# EAGLE design tritag (EAGLE 6.5.0)
AUTHOR: Brad Campbell; REV: A; TITLE: TriTag

## Sheet 1 of 2
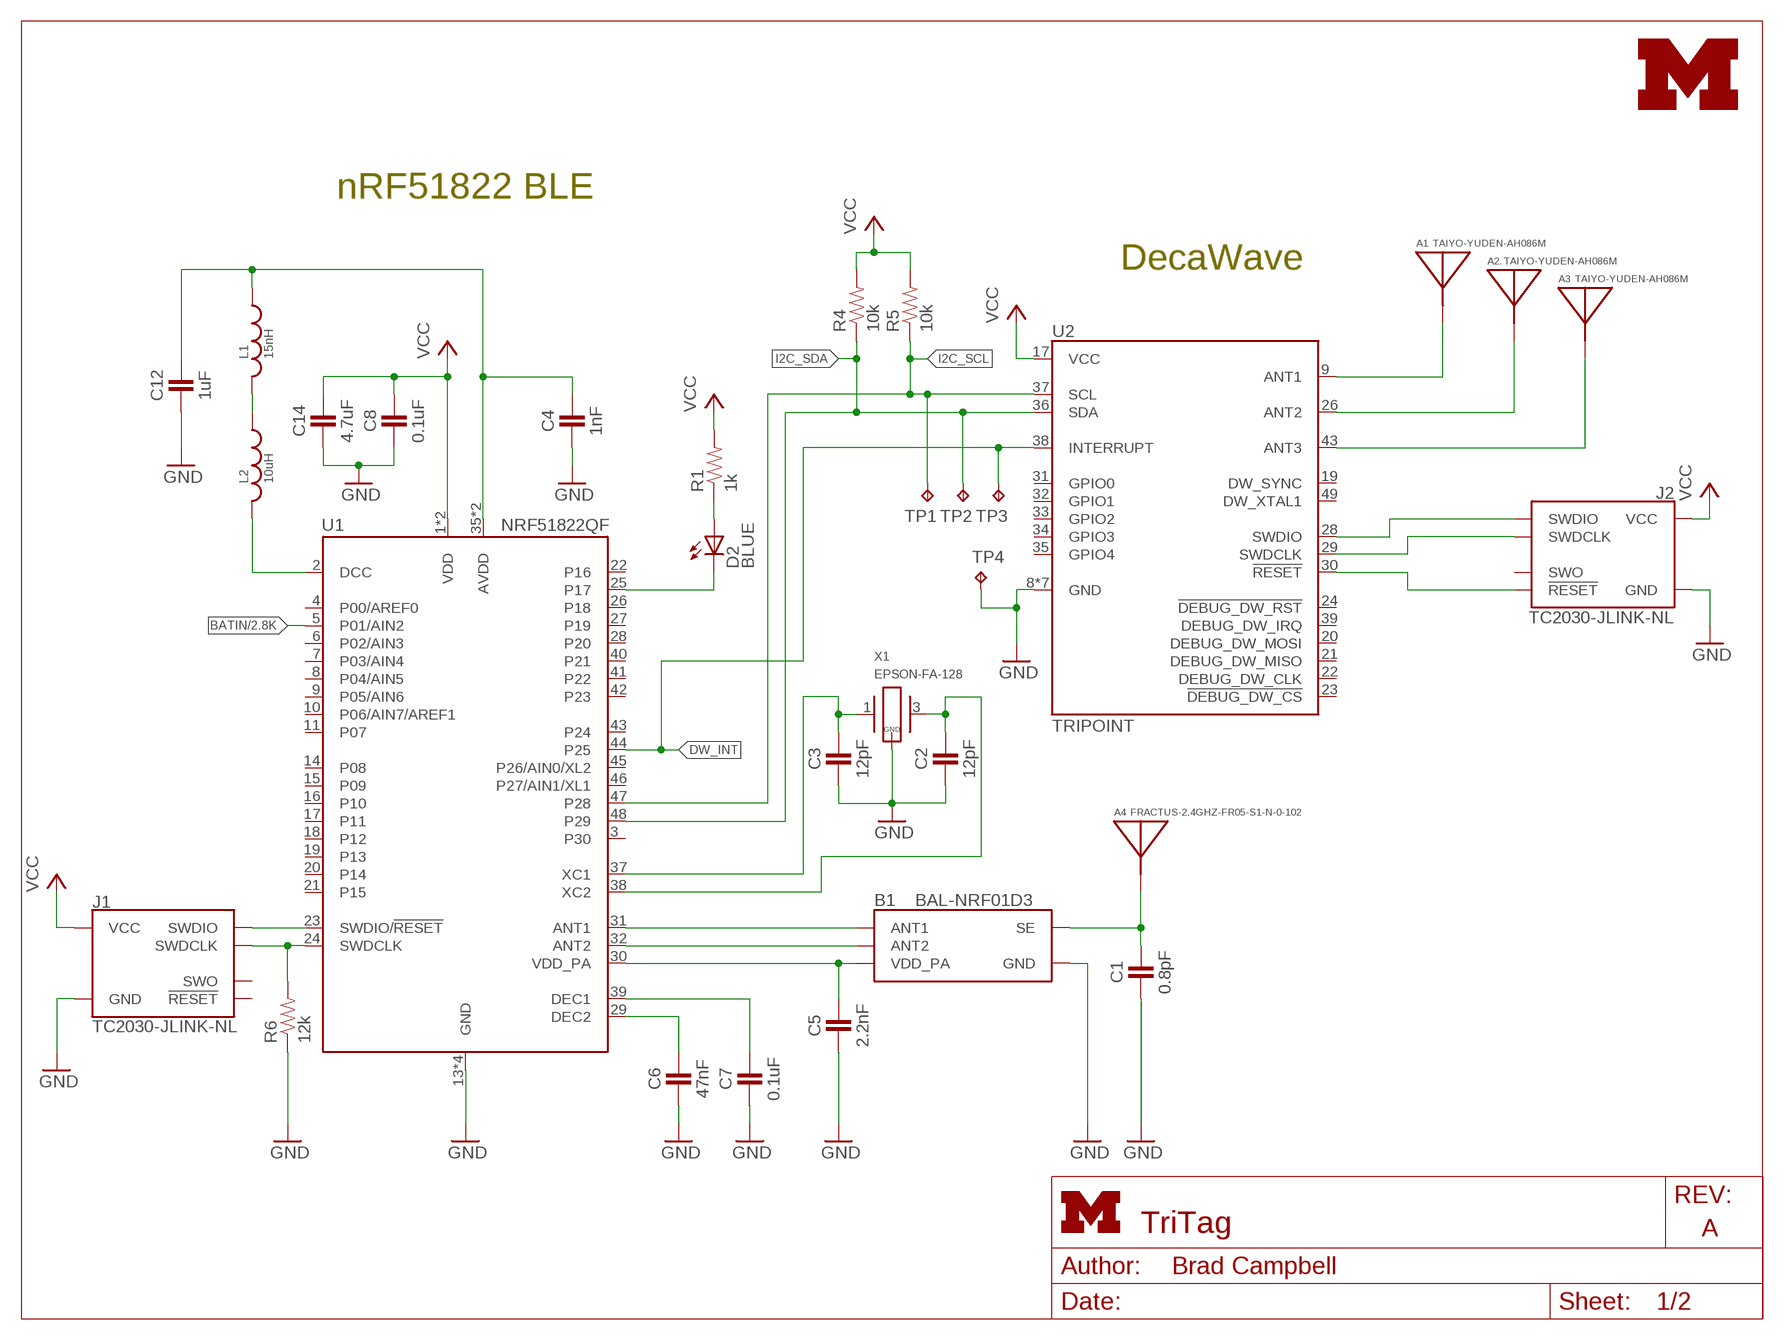
[diagram p0: schematic, sheet 1]
FRAME2 (LETTER_L): HEIGHT: 8.5in; WIDTH: 11in

### Parts
A1  TAIYO-YUDEN-AH086M  [TAIYO-YUDEN-AH086M]
A2.  TAIYO-YUDEN-AH086M  [TAIYO-YUDEN-AH086M]
A3  TAIYO-YUDEN-AH086M  [TAIYO-YUDEN-AH086M]
A4  FRACTUS-2.4GHZ-FR05-S1-N-0-102  [FRACTUS-ANTENNA-FR05-S1-N-0-102]
B1  BAL-NRF01D3  [BAL-NRF01D3]
C1  0.8pF  CAPACITOR  [0402_CAP]
C2  12pF  CAPACITOR  [0402_CAP]
C3  12pF  CAPACITOR  [0402_CAP]
C4  1nF  CAPACITOR  [0402_CAP]
C5  2.2nF  CAPACITOR  [0402_CAP]
C6  47nF  CAPACITOR  [0402_CAP]
C7  0.1uF  CAPACITOR  [0402_CAP]
C8  0.1uF  CAPACITOR  [0402_CAP]
C12  1uF  CAPACITOR  [0402_CAP]
C14  4.7uF  CAPACITOR  [0402_CAP]
D2  BLUE  LED0603  [LED-0603]
J1  TC2030-JLINK-NL  [TC2030-IDC-NL]
J2  TC2030-JLINK-NL  [TC2030-IDC-NL]
L1  15nH  INDUCTOR0402  [0402_CAP]
L2  10uH  INDUCTOR0603  [0603_CAP]
LOGO1  UMICH_SOLID_SMALL  [UMICH_SOLID_75MIL]
R1  1k  RESISTOR0402_RES  [0402_RES]
R4  10k  RESISTOR0402_RES  [0402_RES]
R5  10k  RESISTOR0402_RES  [0402_RES]
R6  12k  RESISTOR0402_RES  [0402_RES]
TP1  TPTP06SQ  [TP06SQ]
TP2  TPTP06SQ  [TP06SQ]
TP3  TPTP06SQ  [TP06SQ]
TP4  TPTP06SQ  [TP06SQ]
U1  NRF51822QF  [QFN-48-6MM]
U2  TRIPOINT  [TRIPOINT]
X1  EPSON-FA-128  [FA-128]

### Nets
!CHRG1: D2.A R1.1
ANTENNA: A4.1(ANTENNA) B1.SE C1.1
AVDD: C4.1 C12.1 L1.1 U1.35(AVDD) U1.36(AVDD)
BATIN: U1.5(P01/AIN2) ; also sheet 2
DCC: L2.2 U1.2(DCC)
DW_INT: TP3.TP U1.44(P25) U2.38(INTERRUPT)
GND: B1.GND C1.2 C2.2 C3.2 C4.2 C5.2 C6.2 C7.2 C8.2 C12.2 C14.2 J1.5(GND) J2.5(GND) R6.1 TP4.TP U1.13(GND) U1.33(GND) U1.34(GND) U1.GND U2.8(GND) U2.10(GND) U2.18(GND) U2.25(GND) U2.27(GND) U2.42(GND) U2.44(GND) X1.2(GND) X1.4(GND) ; also sheet 2
I2C_SCL: R5.1 TP1.TP U1.47(P28) U2.37(SCL)
I2C_SDA: R4.1 TP2.TP U1.48(P29) U2.36(SDA)
N$1: A1.A(ANTENNA) U2.9(ANT1)
N$2: A2..A(ANTENNA) U2.26(ANT2)
N$3: A3.A(ANTENNA) U2.43(ANT3)
N$4: J2.2(SWDIO) U2.28(SWDIO)
N$6: D2.C U1.25(P17)
N$7: J2.4(SWDCLK) U2.29(SWDCLK)
N$8: J2.3(!RESET) U2.30(!RESET)
N$9: C3.1 U1.37(XC1) X1.1
N$10: C2.1 U1.38(XC2) X1.3
N$15: C6.1 U1.29(DEC2)
N$17: C7.1 U1.39(DEC1)
N$18: B1.ANT1 U1.31(ANT1)
N$19: B1.ANT2 U1.32(ANT2)
N$20: B1.VCC(VDD_PA) C5.1 U1.30(VDD_PA)
N$37: L1.2 L2.1
SWDCLK: J1.4(SWDCLK) R6.2 U1.24(SWDCLK)
SWDIO/!RESET: J1.2(SWDIO) U1.23(SWDIO/!RESET)
VCC: C8.1 C14.1 J1.1(VCC) J2.1(VCC) R1.2 R4.2 R5.2 U1.1(VDD) U1.12(VDD) U2.17(VCC) ; also sheet 2
Unconnected: J1.3(!RESET) J1.6(SWO) J2.6(SWO) U1.3(P30) U1.4(P00/AREF0) U1.6(P02/AIN3) U1.7(P03/AIN4) U1.8(P04/AIN5) U1.9(P05/AIN6) U1.10(P06/AIN7/AREF1) U1.11(P07) U1.14(P08) U1.15(P09) U1.16(P10) U1.17(P11) U1.18(P12) U1.19(P13) U1.20(P14) U1.21(P15) U1.22(P16) U1.26(P18) U1.27(P19) U1.28(P20) U1.40(P21) U1.41(P22) U1.42(P23) U1.43(P24) U1.45(P26/AIN0/XL2) U1.46(P27/AIN1/XL1) U2.19(DW_SYNC) U2.20(DEBUG_DW_MOSI) U2.21(DEBUG_DW_MISO) U2.22(DEBUG_DW_CLK) U2.23(!DEBUG_DW_CS) U2.24(!DEBUG_DW_RST) U2.31(GPIO0) U2.32(GPIO1) U2.33(GPIO2) U2.34(GPIO3) U2.35(GPIO4) U2.39(DEBUG_DW_IRQ) U2.49(DW_XTAL1)

### Notes on the sheet
- nRF51822 BLE
- DecaWave

## Sheet 2 of 2
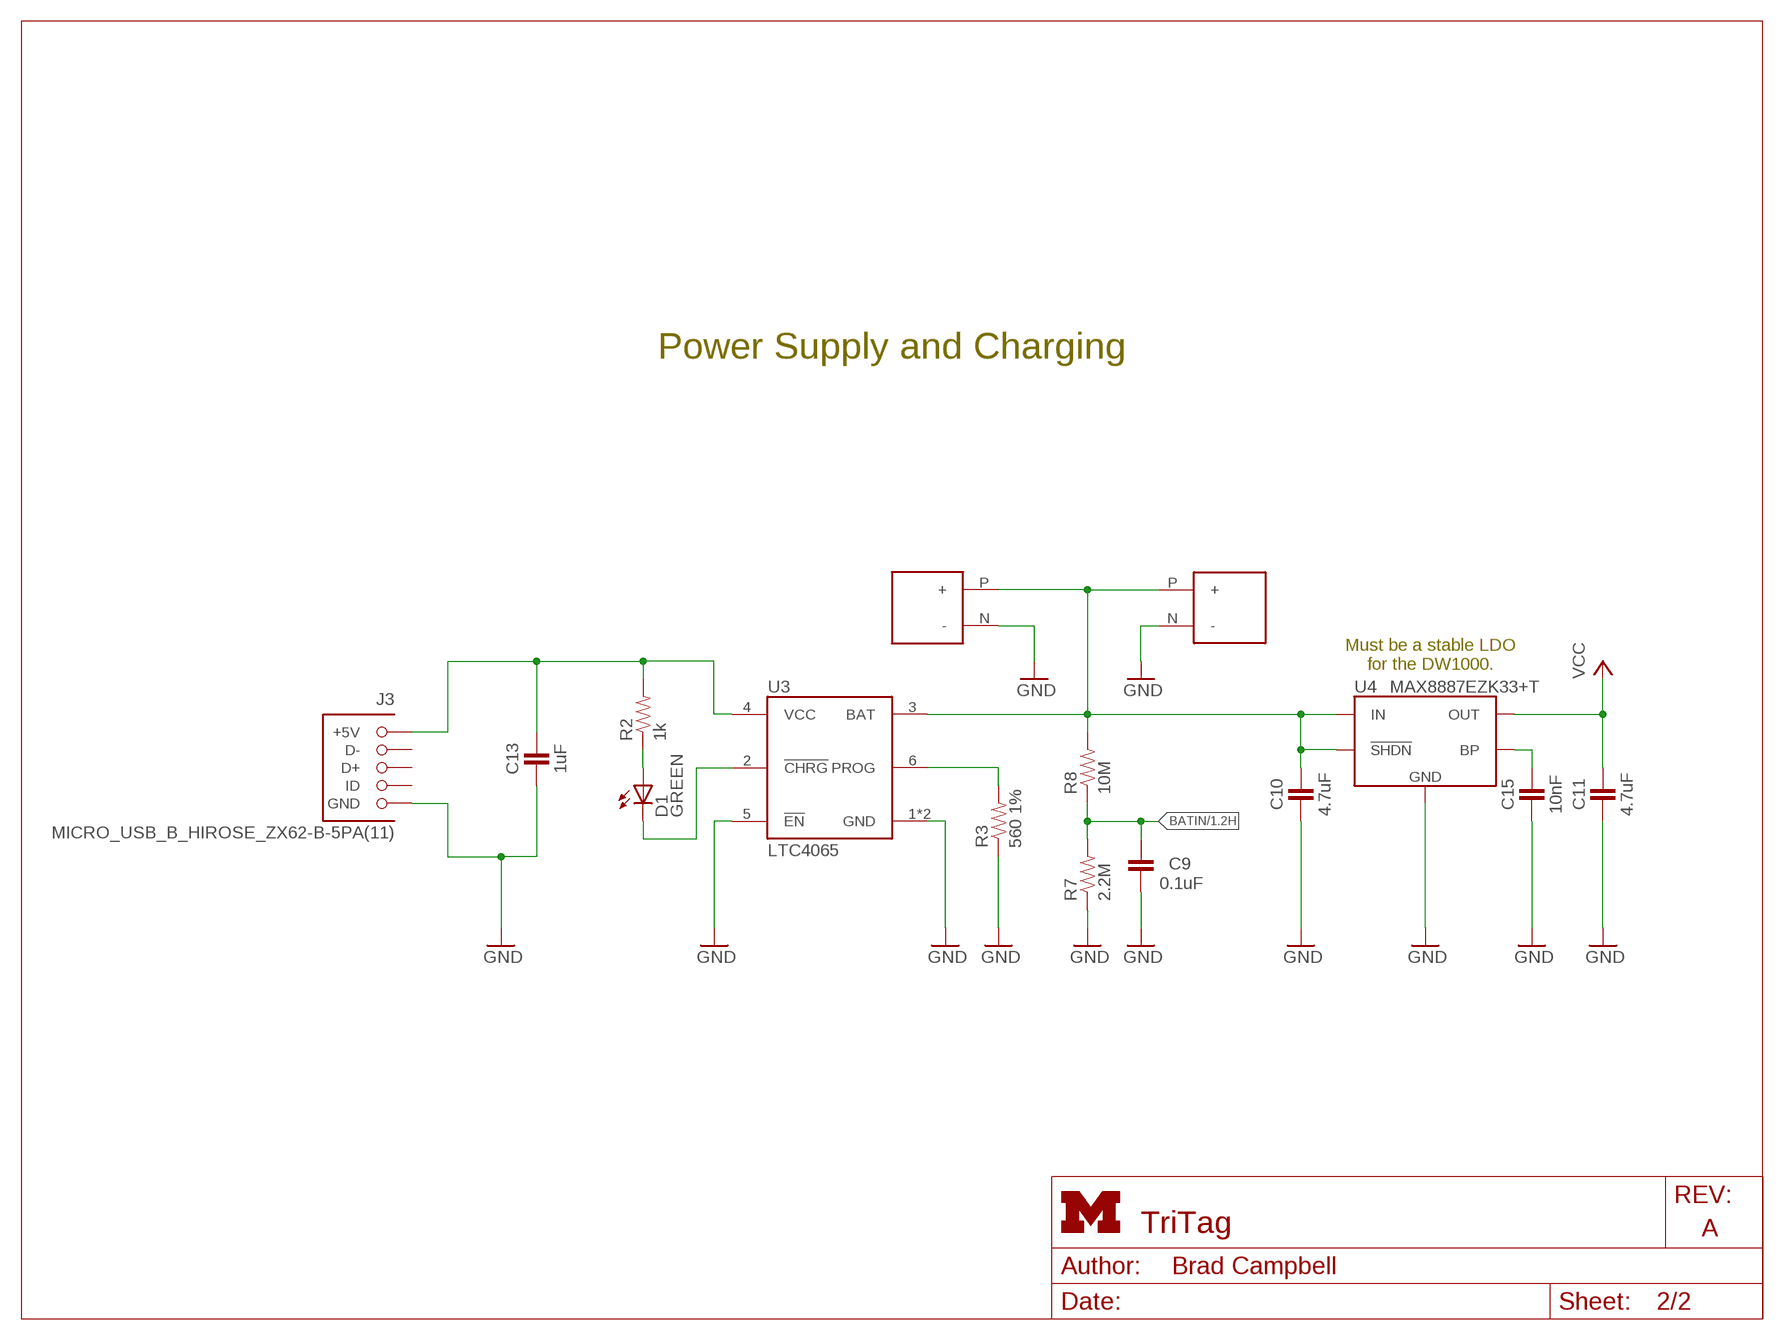
[diagram p1: schematic, sheet 2]
FRAME1 (LETTER_L): HEIGHT: 8.5in; WIDTH: 11in

### Parts
C9  0.1uF  CAPACITOR  [0402_CAP]
C10  4.7uF  CAPACITOR  [0402_CAP]
C11  4.7uF  CAPACITOR  [0402_CAP]
C13  1uF  CAPACITOR  [0402_CAP]
C15  10nF  CAPACITOR  [0402_CAP]
D1  GREEN  LED0603  [LED-0603]
J3  MICRO_USB_B_HIROSE_ZX62-B-5PA(11)  [USB_MICRO_B-HIROSE-ZX62-B-5PA(11)]
J4  BAT_HOLE  [BATTERY_HOLE]
J5  BAT_HOLE  [BATTERY_HOLE]
R2  1k  RESISTOR0402_RES  [0402_RES]
R3  560 1%  RESISTOR0402_RES  [0402_RES]
R7  2.2M  RESISTOR0402_RES  [0402_RES]
R8  10M  RESISTOR0402_RES  [0402_RES]
U3  LTC4065  [DFN-6/2MM]
U4  MAX8887EZK33+T  [SOT-23-5]

### Nets
!CHRG: D1.A R2.1
BATIN: C9.2 R7.2 R8.1 ; also sheet 1
GND: C9.1 C10.2 C11.2 C13.2 C15.2 J3.5(GND) J4.N(-) J5.N(-) R3.1 R7.1 U3.1(GND) U3.5(!EN) U3.7(GND) U4.2(GND) ; also sheet 1
N$5: D1.C U3.2(!CHRG)
N$11: C15.1 U4.4(BP)
N$13: R3.2 U3.6(PROG)
VBAT: C10.1 J4.P(+) J5.P(+) R8.2 U3.3(BAT) U4.1(IN) U4.3(!SHDN)
VCC: C11.1 U4.5(OUT) ; also sheet 1
VUSB: C13.1 J3.1(+5V) R2.2 U3.4(VCC)
Unconnected: J3.2(D-) J3.3(D+) J3.4(ID)

### Notes on the sheet
- Power Supply and Charging
- Must be a stable LDO
  for the DW1000.

## Library data of the parts
A1 A2. A3 = chips:TAIYO-YUDEN-AH086M: UWB Antenna - 3.1-8GHz; DIGIKEY: 587-2204-1-ND
A4 = chips:FRACTUS-2.4GHZ-FR05-S1-N-0-102: Fractus Compact Reach XtendTM chip antenna is engineered specifically for Bluetooth, WLAN 802.11 b/g/n and other wireless devices operating at the ISM 2.4 GHz band. Compact Reach Xtend combines small form factor size and high performance to improve the functionality of your wireless devices.; RICHARDSON_RFPD: FR05-S1-N-0102B
B1 = chips:BAL-NRF01D3: 50 ohm nominal input / conjugate match balun to nRF51422-QFAA, nRF24LE1, nRF51822-QFAA/AB, with integrated harmonic filter; DIGIKEY: 497-13637-1-ND; MOUSER: 511-BAL-NRF01D3
C1-C15 = passives:CAPACITOR: 0402 Capacitor
D1 D2 = SparkFun-LED:LED: LEDs Standard schematic elements and footprints for 5mm, 3mm, 1206, and 0603 sized LEDs. 5mm - Spark Fun Electronics SKU : COM-00529 (and others)
J1 J2 = connector:TC2030-JLINK
J3 = connector:MICRO_USB_B_HIROSE_ZX62-B-5PA(11): Connector Receptacle USB - micro B 2.0 5 Position Surface Mount, Right Angle, Horizontal Bottom Mount; DIGIKEY: H11634CT-ND; MOUSER: 798-ZX62-B-5PA11; NEWARK: 86P8793
J4 J5 = connector:BAT_HOLE
L1 L2 = passives:INDUCTOR
LOGO1 = logos:UMICH_SOLID
R1-R8 = passives:RESISTOR: Resistor Basic schematic elements and footprints for 0603, 1206, and PTH resistors.
TP1-TP4 = testpad:TP: Test pad
U1 = chips:NRF51822: Multiprotocol Bluetooth® 4.0 low energy/2.4 GHz RF SoC; DIGIKEY: 1490-1032-1-ND; MOUSER: 949-NRF51822-QFAB-R7
U2 = tripoint:TRIPOINT: UWB Ranging Module
U3 = chips:LTC4065: LION/LIPO Battery Charging IC Low current; DIGIKEY: LTC4065LEDC#TRMPBF
U4 = chips:MAX8887: IC REG LDO 3.3V 0.3A TSOT23-5; DIGIKEY: MAX8887EZK33+TCT-ND
X1 = crystals:EPSON-FA-128: MHz RANGE CRYSTAL UNIT ULTRA MINIATURE SIZE LOW PROFILE SMD http://www.digikey.com/product-search/en?FV=ffec63d1

## Board
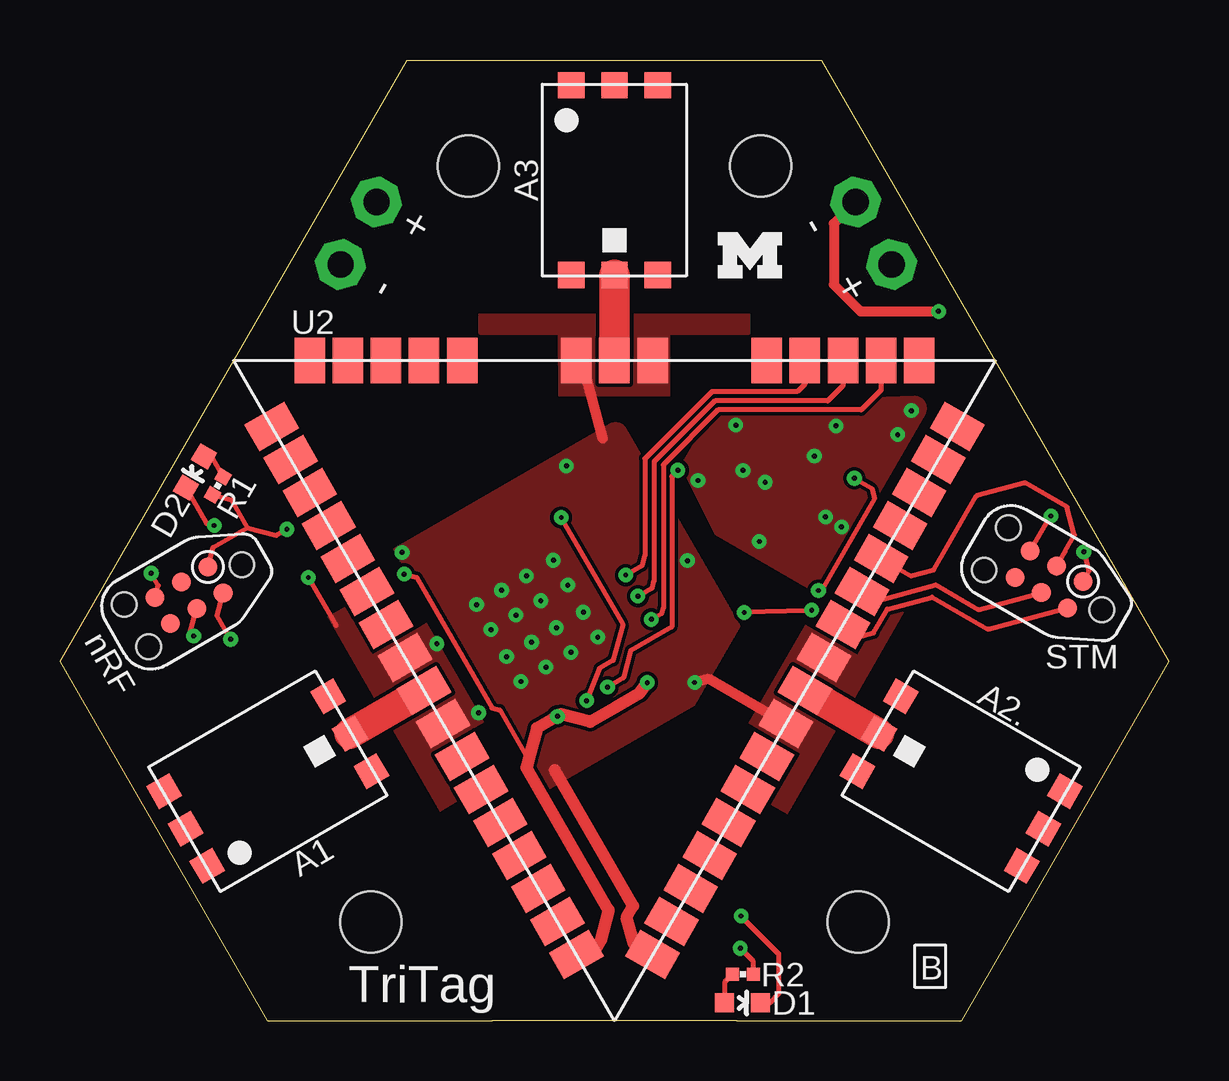
[diagram p2: board, top side]
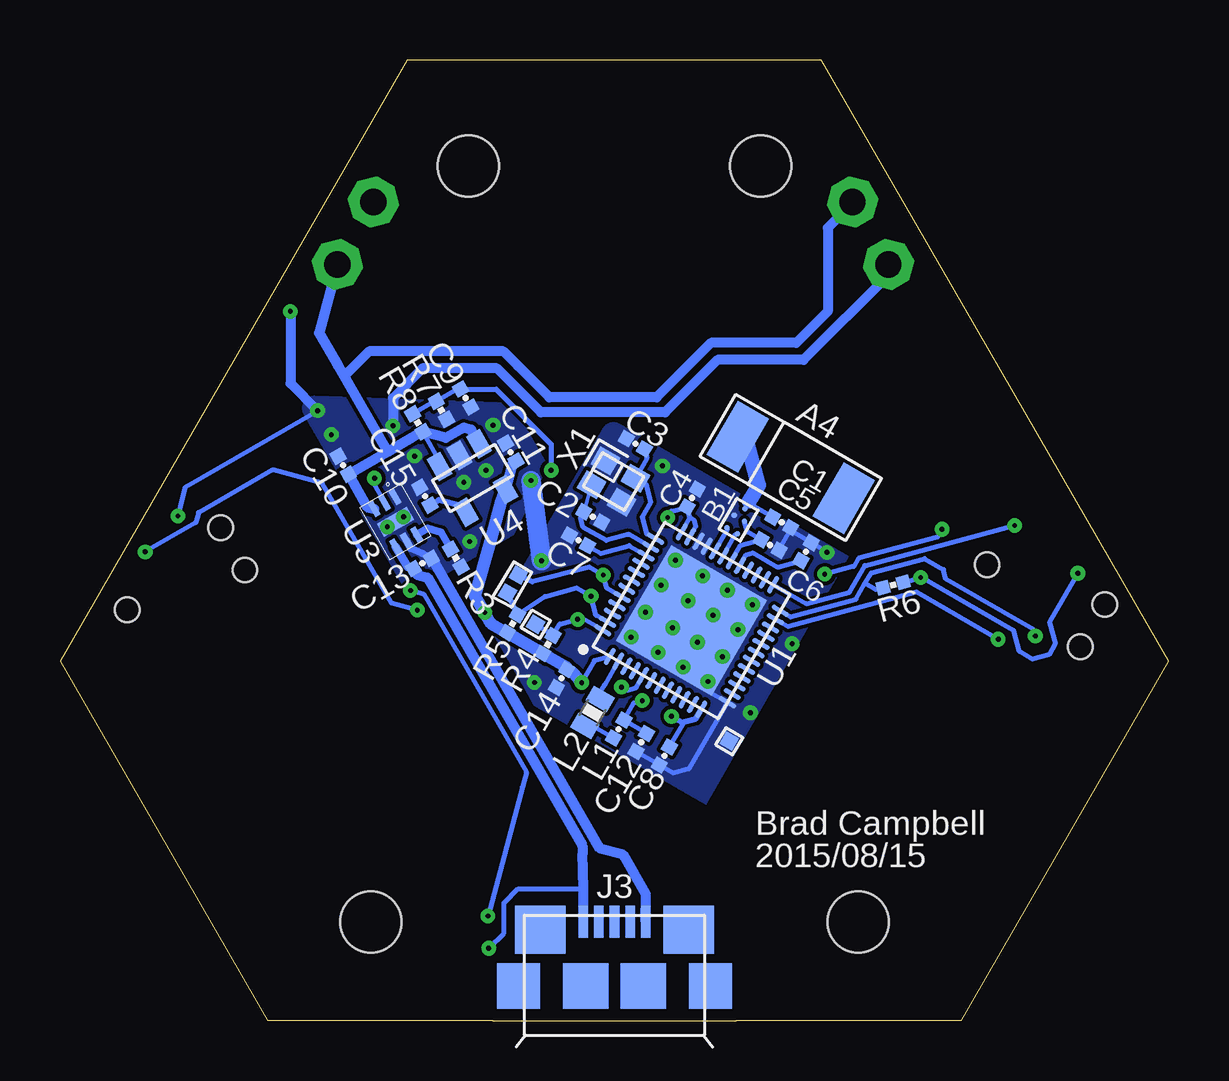
[diagram p3: board, bottom side, seen from below]

Size 46.23 x 40.03 mm. Coordinates in mm from the lower left corner, seen from the top.
Outline: 18.03,0 8.66,0 0,14.99 14.48,40.03 31.75,40.03 46.23,14.99 37.57,0 28.19,0
Copper layers (1*16): Top 0.0178mm / dielectric 59mil / Bottom 0.0178mm
Design rules "sunstone-2lyr_v1.0.0.3 *": minimum track width 6mil, minimum drill 14mil, track to track 6mil, track to pad 6mil, pad to pad 6mil, via to via 6mil, smd to smd 6mil, copper to edge 10mil, drill to drill 16mil, minimum pad ring 8mil, minimum via ring 8mil, stop-mask expansion 3mil, vias tented up to drill 50mil, thermal gap 10mil
Holes 2.54 mm at 33.27,4.11 12.95,4.11 17.02,35.61 29.21,35.61

### Footprints (pad centres in the part's own frame; a part is rotated, then mirrored left to right if it is on the bottom)
TAIYO-YUDEN-AH086M = smd 1.1 x 1.1: A 0,-3.95; NC0 -1.8,3.95; NC1 0,3.95; NC2 1.8,3.95; NC3 1.8,-3.95; NC4 -1.8,-3.95
FRACTUS-ANTENNA-FR05-S1-N-0-102 = smd 1.5 x 2.6: 1 -2.55,0; 2 2.55,0
BAL-NRF01D3 = smd 0.22 x 0.22: ANT1 -0.537,-0.25; ANT2 -0.537,0.25; GND 0.069,0.25; SE 0.537,0; VCC 0.069,-0.25
0402_CAP = smd 0.536 x 0.546: 1 -0.433,0; 2 0.433,0
LED-0603 = smd 0.8 x 0.8: A 0,-0.75; C 0,0.75
TC2030-IDC-NL = smd 0.787 x 0.787: 1 -1.27,-0.635; 2 -1.27,0.635; 3 0,-0.635; 4 0,0.635; 5 1.27,-0.635; 6 1.27,0.635 | hole 1.016: -2.54,0; 2.54,1.016; 2.54,-1.016
USB_MICRO_B-HIROSE-ZX62-B-5PA(11) = smd 0.4 x 1.35: 1 -1.3,4.125; 2 -0.65,4.125; 3 0,4.125; 4 0.65,4.125; 5 1.3,4.125 | smd 2.1 x 2: P$1 3.1,3.8; P$2 -3.1,3.8 | smd 1.8 x 1.9: P$3 -4,1.45; P$6 4,1.45 | smd 1.9 x 1.9: P$4 -1.2,1.45; P$5 1.2,1.45
BATTERY_HOLE = drill 1.1 pad 2 octagon: N 1.5,0; P -1.5,0
0603_CAP = smd 0.7 x 1: 1 -0.65,0; 2 0.65,0
0402_RES = smd 0.536 x 0.546: 1 -0.433,0; 2 0.433,0
TP06SQ = smd 0.6 x 0.6: TP 0,0
QFN-48-6MM = smd 0.8 x 0.203: 1 -3,2.2; 2 -3,1.8; 3 -3,1.4; 4 -3,1; 5 -3,0.6; 6 -3,0.2; 7 -3,-0.2; 8 -3,-0.6; 9 -3,-1; 10 -3,-1.4; 11 -3,-1.8; 12 -3,-2.2; 25 3,-2.2; 26 3,-1.8; 27 3,-1.4; 28 3,-1; 29 3,-0.6; 30 3,-0.2; 31 3,0.2; 32 3,0.6; 33 3,1; 34 3,1.4; 35 3,1.8; 36 3,2.2 | smd 0.203 x 0.8: 13 -2.2,-3; 14 -1.8,-3; 15 -1.4,-3; 16 -1,-3; 17 -0.6,-3; 18 -0.2,-3; 19 0.2,-3; 20 0.6,-3; 21 1,-3; 22 1.4,-3; 23 1.8,-3; 24 2.2,-3; 37 2.2,3; 38 1.8,3; 39 1.4,3; 40 1,3; 41 0.6,3; 42 0.2,3; 43 -0.2,3; 44 -0.6,3; 45 -1,3; 46 -1.4,3; 47 -1.8,3; 48 -2.2,3 | smd 4.6 x 4.6: GND 0,0
TRIPOINT = smd 1.27 x 1.905 rotated 120: 1 -14.287,6.417; 2 -13.494,5.042; 3 -12.7,3.667; 4 -11.906,2.292; 5 -11.113,0.917; 6 -10.319,-0.458; 7 -9.525,-1.833; 8 -8.731,-3.208; 9 -7.938,-4.583; 10 -7.144,-5.958; 11 -6.35,-7.332; 12 -5.556,-8.707; 13 -4.763,-10.082; 14 -3.969,-11.457; 15 -3.175,-12.832; 16 -2.381,-14.207; 17 -1.587,-15.582 | smd 1.27 x 1.905 rotated 60: 18 1.587,-15.582; 19 2.381,-14.207; 20 3.175,-12.832; 21 3.969,-11.457; 22 4.763,-10.082; 23 5.556,-8.707; 24 6.35,-7.332; 25 7.144,-5.958; 26 7.938,-4.583; 27 8.731,-3.208; 28 9.525,-1.833; 29 10.319,-0.458; 30 11.113,0.917; 31 11.906,2.292; 32 12.7,3.667; 33 13.494,5.042; 34 14.287,6.417 | smd 1.27 x 1.905: 35 12.7,9.171; 36 11.113,9.171; 37 9.525,9.171; 38 7.938,9.171; 39 6.35,9.171; 42 1.587,9.171; 43 0,9.171; 44 -1.587,9.171; 47 -6.35,9.171; 48 -7.938,9.171; 49 -9.525,9.171; 50 -11.113,9.171; 51 -12.7,9.171
DFN-6/2MM = smd 0.25 x 0.675: 1 -0.5,-0.91; 2 0,-0.91; 3 0.5,-0.91; 4 0.51,0.91; 5 0,0.91; 6 -0.5,0.91 | smd 1.42 x 0.61: 7 0,0
SOT-23-5 = smd 0.65 x 1.06: 1 -0.95,-1.1; 2 0,-1.1; 3 0.95,-1.1; 4 0.95,1.1; 5 -0.95,1.1
FA-128 = smd 0.95 x 0.85: 1 -0.725,-0.575; 2 0.725,-0.575; 3 0.725,0.575; 4 -0.725,0.575

### Placement (x,y rotation side)
A1  8.66,9.98 120 top
A2.  37.57,9.98 240 top
A3  23.11,35.03 0 top
A4  15.76,23.05 330 bottom
B1  17.94,20.87 60 bottom
C1  16.14,20.76 330 bottom
C2  24.02,20.99 330 bottom
C3  22.24,24.04 150 bottom
C4  19.88,21.78 60 bottom
C5  16.63,19.82 330 bottom
C6  15.13,19.54 60 bottom
C7  24.61,20.02 150 bottom
C8  21.03,11.04 240 bottom
C9  29.32,25.95 120 bottom
C10  34.42,23.15 120 bottom
C11  27.44,23.69 120 bottom
C12  22,11.6 240 bottom
C13  31.13,19.06 30 bottom
C14  25.32,14.26 240 bottom
C15  31.01,21.86 120 bottom
D1  28.45,0.74 270 top
D2  5.63,22.86 150 top
J1  5.38,17.73 210 top
J2  41.22,18.39 150 top
J3  23.11,0 0 bottom
J4  33.91,32.82 120 top
J5  12.45,32.82 240 top
L1  22.94,12.15 240 bottom
L2  24.03,12.84 60 bottom
LOGO1  27.43,30.94 0 top
R1  6.58,22.29 240 top
R2  28.47,1.94 0 top
R3  29.73,19.29 120 bottom
R4  25.89,15.68 240 bottom
R5  27.37,16.54 240 bottom
R6  11.5,18.16 195 bottom
R7  30.33,25.44 120 bottom
R8  31.31,24.91 300 bottom
TP1  27.57,17.82 330 bottom
TP2  26.41,16.52 330 bottom
TP3  27.13,18.57 330 bottom
TP4  18.34,11.65 330 bottom
U1  19.9,16.67 60 bottom
U2  23.11,18.34 0 top
U3  32.25,20.79 210 bottom
U4  29.03,22.61 210 bottom
X1  23.15,22.47 150 bottom

### Tracks (layer width: path | path; a pad name or v marks a point on that pad's centre or on a via)
!CHRG
  Top 0.203: R2.1 27.7,1.6 D1.A
!CHRG1
  Top 0.203: D2.A 6.36,23.42 R1.1
ANTENNA
  Bottom 0.203: C1.1 17.31,21.44 17.35,21.46 17.43,21.76 | 17.49,21.65 B1.SE
  Bottom 0.635: A4.1 17.59,24.1 17.11,22.31 17.43,21.76 17.49,21.65
AVDD  (via drill 0.2)
  Top 0.203: v20.89,20.97 23.46,16.52 23.06,15.01 22.48,14.68 v21.95,13.34
  Bottom 0.203: U1.36 19.97,20.95 | 19.97,20.95 C4.1 20.74,21.23 v20.89,20.97 | U1.35 19.72,20.6 19.78,20.84 19.97,20.95 | C12.1 21.78,11.98 L1.1 22.31,13.24 v21.95,13.34
BATIN  (via drill 0.2)
  Top 0.203: v25.76,22.94 25.5,22.68 25.5,16.41 23.79,15.42 23.48,14.28 v22.82,13.9
  Bottom 0.203: R8.1 30.6,25.83 R7.2 29.62,26.34 C9.2 28.05,26.32 25.76,24.03 v25.76,22.94 | v22.82,13.9 22.6,13.77 22.21,13.88 U1.5
DCC
  Bottom 0.203: U1.2 23.53,13.99 23.71,13.68 L2.2
DW_INT  (via drill 0.2)
  Top 0.203: U2.38 31.05,26.53 30.73,26.21 27.18,26.21 24.38,23.42 24.38,19.38 24.27,18.97 v23.58,18.57
  Bottom 0.203: U1.44 23.43,18.02 v23.58,18.57 24.15,18.9 26.54,18.29 TP3.TP
GND  (via drill 0.2)
  Top 0.203: J1.5 4.1,18.13 v3.8,18.65 | v10.35,18.47 11.51,16.47 | J2.5 41.28,21.02 v41.31,21.03
  Top 0.406: J4.N 32.25,33.21 32.25,30.68 33.37,29.56 v36.62,29.56 | U2.25 27.03,14.25 v26.45,14.09 | U2.44 21.78,27.36 C3.2
  Top 0.508: U2.18 23.92,3.21 23.62,4.32 23.89,4.78 20.62,10.44
  Bottom 0.203: C5.2 15.75,20.48 C1.2 15.73,20.39 C6.2 14.27,19.55 v14.26,19.51 | v19.21,14.13 19.09,13.66 U1.13 20.01,10.49 20.65,10.32 C8.2 C12.2 | R6.1 v10.35,18.47 10.36,18.5 6.47,16.26 6.24,15.39 5.69,15.07 4.99,15.26 4.74,15.7 4.98,16.6 v3.8,18.65 | v41.31,21.03 40.98,22.25 v35.49,25.42
  Bottom 0.305: U3.5 31.61,19.69 31.13,19.47 C13.2
  Bottom 0.406: v36.62,29.56 36.62,26.55 v35.49,25.42 | J3.5 21.8,5.28 22.74,6.91 23.71,7.17 30.58,19.06 C13.2 | J5.N 11.7,31.07 15.23,27.53 18.81,27.53 21,25.35 26.18,25.35 28.01,27.18 31.12,27.18 32.35,25.94 v32.35,24.79
  Bottom 0.813: v26.6,22.51 v26.15,19.17
  other vias: 22.42,15.98 21.82,17.02 20.57,19.19 21.17,18.15 20.04,17.5 18.61,15.17 19.65,15.77 20.25,14.73 20.69,16.37 21.3,15.35 19.44,18.54 18.4,17.94 19,16.9 17.36,17.34 17.96,16.3 31.45,23.53 29.15,19.97 28.17,24.81 34.92,24.42 31.91,20.99 32.58,20.58 17.45,12.83 15.71,15.71 21.11,23.12 28.47,22.93 29.39,22.44
  pour Bottom (no thermals): 31.69,17.71 36.06,25.27 arc122 35.61,26.03 27.4,25.76 25.87,23.12 27.29,20.25
  pour Top (no thermals): 31.69,17.71 27.29,20.25 25.87,23.12 27.4,25.76 35.61,26.03 arc-122 36.06,25.27
  pour Top (no thermals): 13.89,12.09 15.76,13.17 14.97,14.54 13.1,13.46 11.16,16.82 11.89,17.25 13.03,15.28 14.9,16.36 15.28,16.59 17.68,12.43 15.43,11.13 16.58,9.14 15.84,8.71
  pour Bottom (no thermals): 13.34,19.34 22.91,24.87 arc-90 23.6,24.68 28.36,16.44 26.84,13.81 26.46,13.13 19.31,9
  pour Top: 28.36,16.44 23.6,24.68 arc90 22.91,24.87 13.89,19.66 19.86,9.32 26.46,13.13 27.03,14.14
  pour Top (no thermals): 23.92,29.46 23.92,27.5 22.32,27.5 22.32,29.46 17.45,29.46 17.44,28.58 20.77,28.58 20.77,26.02 25.43,26.02 25.43,28.58 28.76,28.58 28.76,29.46
  pour Top (no thermals): 32.34,12.1 30.32,8.6 29.64,9 30.87,11.13 28.69,12.39 31.07,16.5 33.25,15.24 34.5,17.42 35.19,17.03 33.13,13.46 31.06,14.66 30.27,13.29
I2C_SCL  (via drill 0.2)
  Top 0.203: U2.37 32.64,26.47 32,25.83 27.3,25.83 24.76,23.29 24.76,18.32 24.69,18.03 v24.09,17.69
  Bottom 0.203: U1.47 23.88,16.89 v24.09,17.69 24.69,18.03 26.03,17.67 R5.1 TP1.TP
I2C_SDA  (via drill 0.2)
  Top 0.203: U2.36 34.23,26.28 33.4,25.45 27.43,25.45 25.15,23.16 25.15,17.2 25.09,16.97 v24.65,16.72
  Bottom 0.203: U1.48 24.47,16.77 v24.65,16.72 25.4,16.52 R4.1 TP2.TP
N$1
  Top 1.27: A1.A U2.9
N$2
  Top 1.27: U2.26 A2..A
N$3
  Top 1.27: A3.A U2.43
N$4
  Top 0.203: U2.28 33.45,16.04 33.91,16.16 34.48,17.15 36.36,17.65 38.68,16.31 J2.2
N$5  (via drill 0.2)
  Top 0.203: v33.12,22.6 33.84,22.18 33.96,21.76 31.77,17.97 v31.62,17.93 | v28.39,4.36 29.96,2.79 29.96,1.11 29.59,0.74 D1.C
  Bottom 0.203: v33.12,22.6 33.18,22.42 U3.2 | v28.39,4.36 26.95,9.74 26.78,10.35 31.07,17.78 v31.62,17.93
N$6  (via drill 0.2)
  Top 0.203: v6.43,20.64 6.11,20.72 D2.C
  Bottom 0.203: U1.25 15.12,17.38 13.31,17.86 12.68,18.96 v6.43,20.64
N$7
  Top 0.203: U2.29 34.08,17.51 36.5,18.16 38.27,17.13 J2.4
N$8
  Top 0.203: U2.30 35.48,18.53 36.42,18.79 38.2,21.87 40.24,22.41 41.97,21.41 42.29,20.23 41.89,19.55 J2.3
N$9
  Bottom 0.203: U1.37 21.77,20.29 21.95,20.99 21.59,21.61 21.79,22.34 X1.1 21.76,23.43 C3.1
N$10
  Bottom 0.152: X1.3 C2.1
  Bottom 0.203: U1.38 22.52,20.26 23.45,20.01 24.42,20.57 24.53,20.98 C2.1
N$11
  Bottom 0.254: U4.4 29.44,21.43 30.43,21.69 C15.1
N$13
  Bottom 0.305: U3.6 30.91,20.51 30.35,20.36 R3.2
N$15
  Bottom 0.203: U1.29 17.63,19.41 17.34,19.49 16.33,18.9 C6.1
N$17
  Bottom 0.203: C7.1 23.68,19.48 22.5,19.79 U1.39
N$18
  Bottom 0.203: U1.31 18.06,20.26 B1.ANT1
N$19
  Bottom 0.203: U1.32 18.41,20.46 B1.ANT2
N$20
  Bottom 0.203: U1.30 17.86,19.81 C5.1 17.57,20.37 B1.VCC
N$37
  Bottom 0.203: L1.2 24.13,12.33 L2.1
SWDCLK  (via drill 0.2)
  Top 0.203: v5.57,16.03 5.45,16.24 J1.4
  Bottom 0.203: U1.24 15.77,16.83 13.05,17.56 12.67,18.22 | 12.67,18.22 12.41,18.66 10.19,19.26 9.4,18.8 9.29,18.4 5.64,16.29 v5.57,16.03 | R6.2 12.22,17.96 12.67,18.22
SWDIO/!RESET  (via drill 0.2)
  Top 0.203: v7.12,15.9 6.55,16.88 J1.2
  Bottom 0.203: U1.23 15.88,16.43 10.53,17.87 v7.12,15.9
VBAT
  Bottom 0.203: 13.17,34.08 13.19,34.09 J5.P | 34.38,26.84 34.64,27.29 | U4.3 30.36,23.25 R8.2
  Bottom 0.406: 32.57,23.71 C10.1 33.42,21.4 U3.3 | J4.P 35.43,28.65 34.64,27.29 32.57,23.71 | 13.17,34.08 14.22,33.04 14.22,29.56 15.53,28.24 19.09,28.24 21.36,25.98 25.83,25.98 27.14,27.29 27.74,27.89 33.33,27.89 34.38,26.84 | 32.57,23.71 31.55,24.31 31.13,24.55 R8.2 | U4.1 29.09,24.63 29.4,24.71 30.14,24.28 R8.2 | R8.2 31.06,24.46 31.05,24.46
VCC  (via drill 0.2)
  Top 0.203: J1.1 6.38,19.73 7.8,20.55 | 7.8,20.55 9.02,20.22 v9.46,20.48 | v14.35,18.61 14.87,18.47 18.01,13.03 18.34,12.94 19.52,10.9 19.54,10.89 | R1.2 7.14,21.71 7.8,20.55 | v31.33,17.11 31.16,17.08 v28.52,17.01 | v42.68,19.54 42.89,18.74 J2.1
  Top 0.406: 20.89,12.77 v20.74,12.68
  Top 0.508: 20.89,12.77 22.1,12.45 23.15,13.06 24.15,13.64 v24.48,14.09 | v20.74,12.68 19.88,12.19 19.54,10.89 19.44,10.55 22.87,4.61 22.53,3.34 22.32,2.97 U2.17
  Bottom 0.203: 19.57,12.84 U1.12 | C8.1 20.27,12.36 | 20.27,12.36 20.21,12.46 19.88,12.54 | v9.46,20.48 9.65,20.15 12.95,19.26 13.14,18.93 v14.35,18.61 | v31.33,17.11 32.41,17.4 35.29,22.39 37.37,22.95 40.45,21.17 40.56,20.76 v42.68,19.54 | 20.3,12.43 20.29,12.42 20.27,12.36 | U1.1 23.95,15 v24.48,14.09 | v28.52,17.01 28.46,16.9
  Bottom 0.254: v20.74,12.68 20.3,12.43 19.72,12.59 U1.12
  Bottom 0.406: C14.1 25.13,14.74 | C11.1 27.36,23.23 U4.5
  Bottom 0.508: 25.13,14.74 R4.2 R5.2 27.54,16.13 28.25,16.55 28.46,16.9 28.93,17.69 28.28,19.95 27.82,21.67 U4.5 | C14.1 24.82,14.48 v24.48,14.09
VUSB  (via drill 0.2)
  Top 0.203: R2.2 28.9,2.48 v28.36,3.02
  Bottom 0.203: v28.36,3.02 27.72,3.65 27.72,4.9 27.13,5.49 24.41,5.49
  Bottom 0.356: U3.4 31.75,18.91 C13.1
  Bottom 0.406: J3.1 24.41,5.49 24.44,6.98 24.45,7.28 30.91,18.47 31.35,18.58 C13.1

### Text on the board
tPlace: nRF | STM | B | TriTag
bPlace: Brad Campbell | 2015/08/15
bPlate: B